# Altium schematic sheet Schmitt Trigger Oscillator.schdoc: Schmitt Trigger Oscillator
size A4; Organization: Altium Limited; Address1: L3, 12a Rodborough Rd; Address2: Frenchs Forest; Address3: NSW; Address4: Australia 2086; DocumentNumber: 1; SheetNumber: 1; SheetTotal: 1
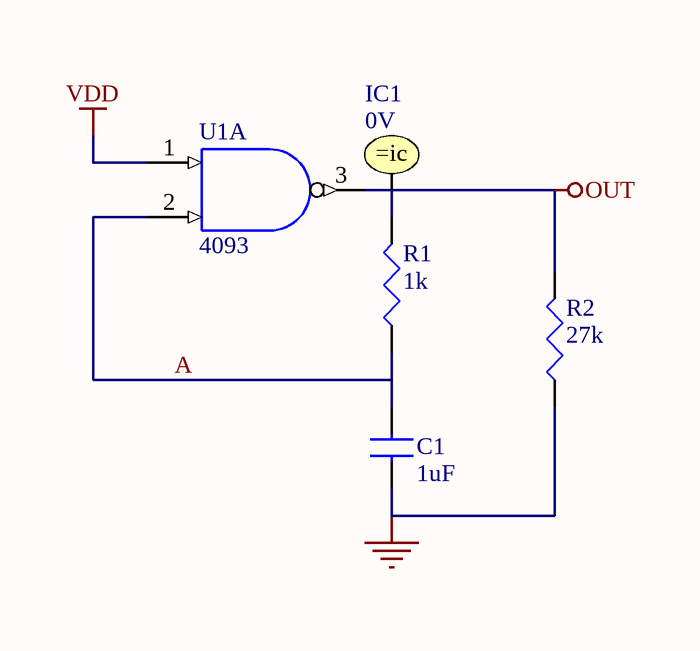
[diagram p0: Schmitt Trigger Oscillator.schdoc]

## Parts
C1  1uF
IC1  Initial Voltage: 0V
R1  1k
R2  27k
U1  4093  (part A of 4)

## Nets
GND: C1.2 R2.2(BOT) U1.7(GND)
OUT: IC1.1 R1.1(TOP) R2.1(TOP) U1.3(1Y)
VDD: U1.1(1A) U1.14(VDD)
A: C1.1 R1.2(BOT) U1.2(1B)

## Notes on the sheet
- Title
- Size:
- Date:
- A4
- Number:
- Time:
- Revision:
- Sheet
- of
- File:

## Library data of the parts
C1 = CAP: Capacitor; Value: 1uF
IC1 = .IC: Initial Condition
R1 R2 = RES: Resistor
  R1: Value: 1k
  R2: Value: 27k
U1 = 4093: Quad 2-Input NAND Schmitt-Trigger